# Altium project Charger.PrjPcb
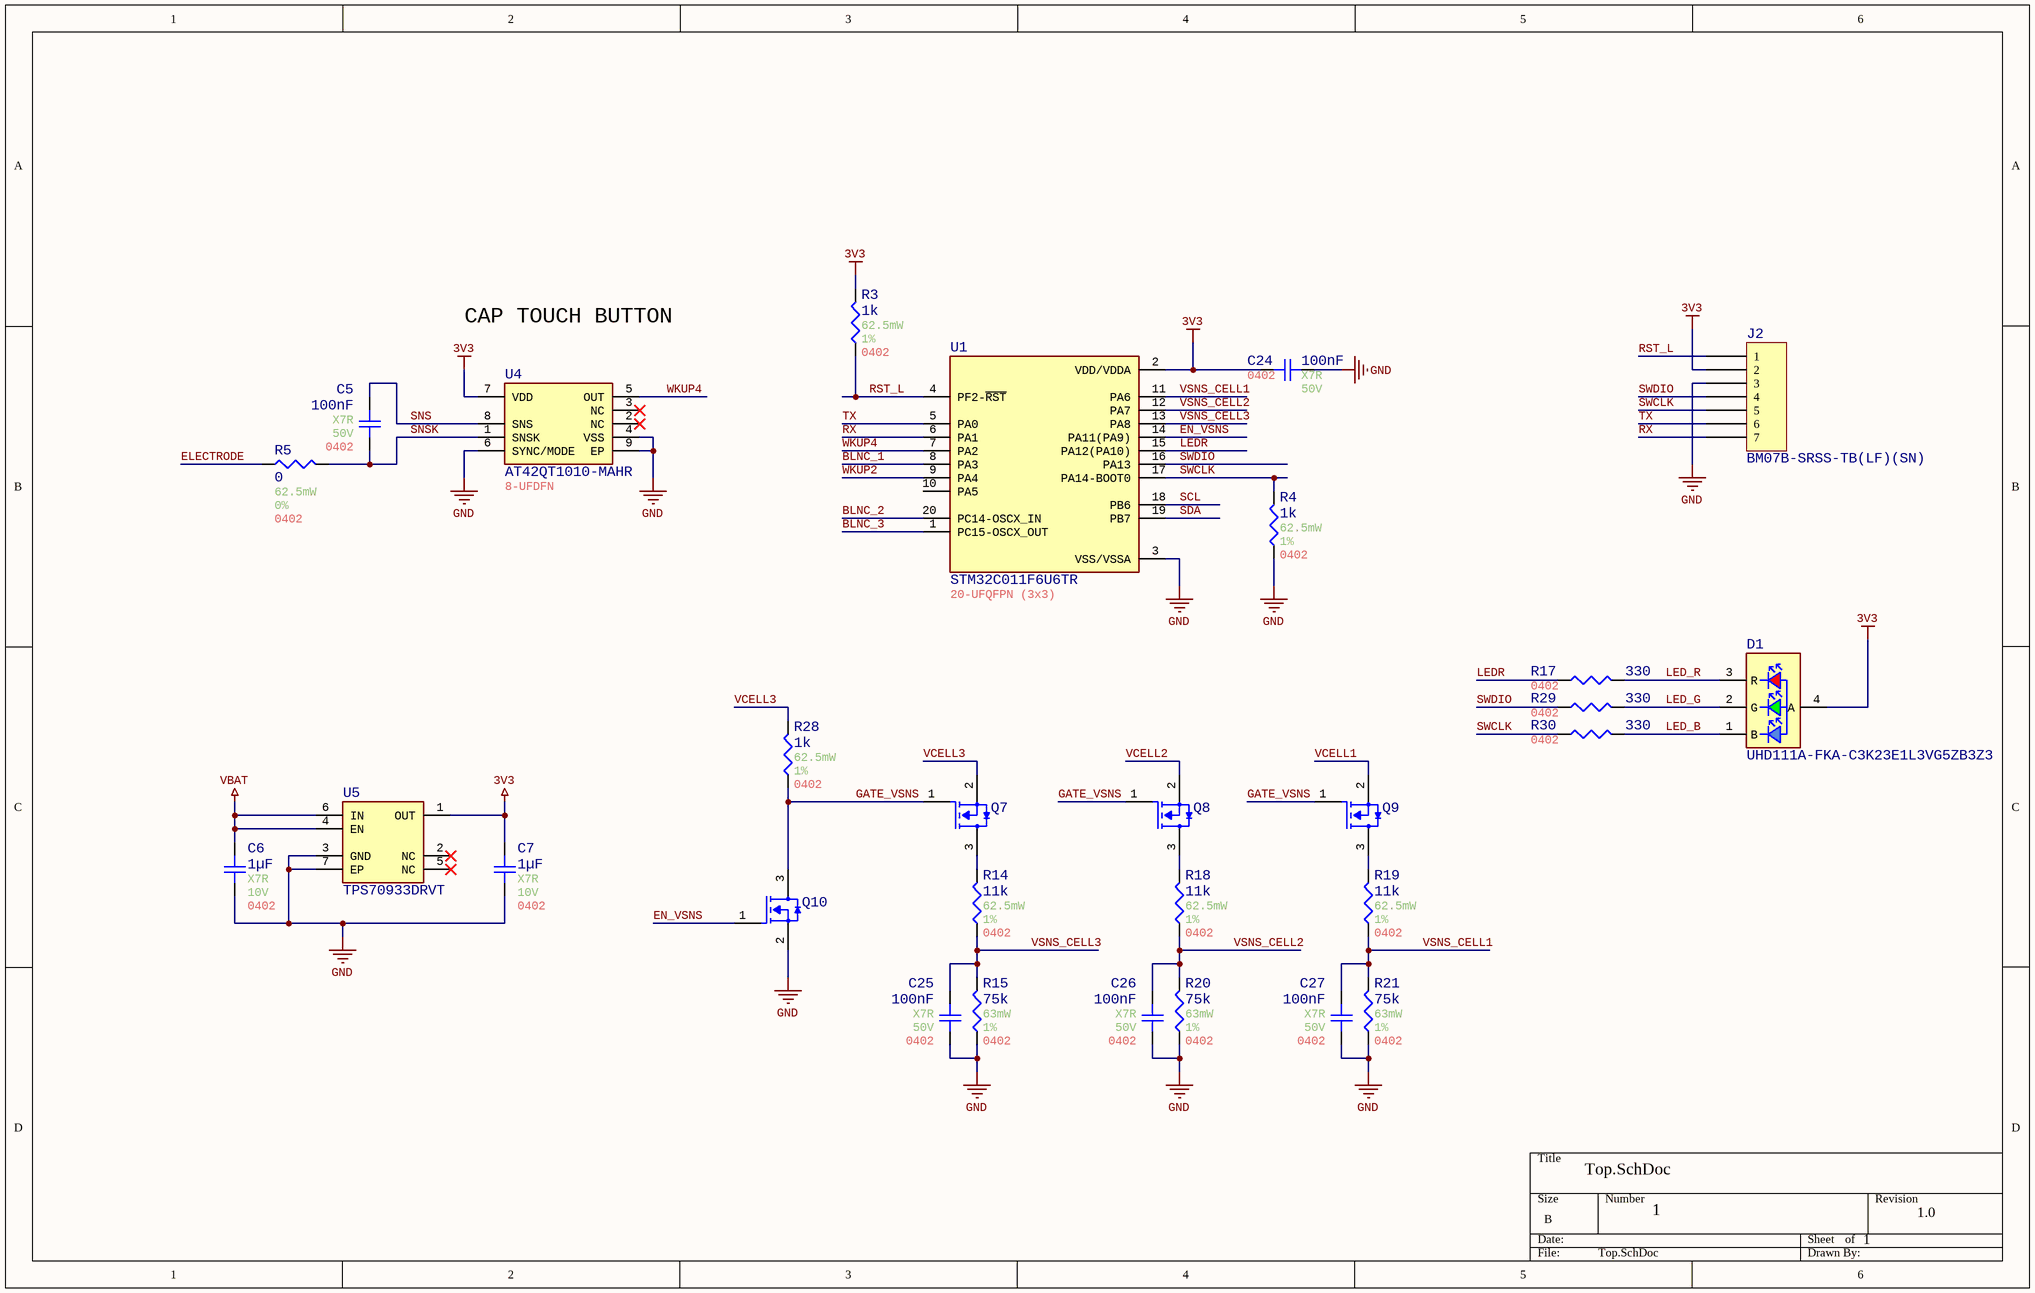
[diagram p0: Top.SchDoc]
ProjectRevision: 1.0
2 sheets, 75 parts. Net scope: global (net labels, ports and power ports of the same name join across sheets).
Board file: Charger.PcbDoc
Sheets:
  Top.SchDoc
  Power.SchDoc

## Sheet Top.SchDoc
size B; DocumentNumber: 1; SheetNumber: 1; SheetTotal: 1

### Parts
C5  value 100nF  Temperature Coefficient: X7R  Voltage Rating: 50V  Case/Package: 0402  [Generic 0402 capacitor]  (hidden comment: GRT155R71H104KE01D)
C6  value 1µF  Temperature Coefficient: X7R  Voltage Rating: 10V  Case/Package: 0402  [Generic 0402 capacitor]  (hidden comment: MAASL105CD7105MFCA01)
C7  value 1µF  Temperature Coefficient: X7R  Voltage Rating: 10V  Case/Package: 0402  [Generic 0402 capacitor]  (hidden comment: MAASL105CD7105MFCA01)
C24  value 100nF  Temperature Coefficient: X7R  Voltage Rating: 50V  Case/Package: 0402  [Generic 0402 capacitor]  (hidden comment: GRT155R71H104KE01D)
C25  value 100nF  Temperature Coefficient: X7R  Voltage Rating: 50V  Case/Package: 0402  [Generic 0402 capacitor]  (hidden comment: GRT155R71H104KE01D)
C26  value 100nF  Temperature Coefficient: X7R  Voltage Rating: 50V  Case/Package: 0402  [Generic 0402 capacitor]  (hidden comment: GRT155R71H104KE01D)
C27  value 100nF  Temperature Coefficient: X7R  Voltage Rating: 50V  Case/Package: 0402  [Generic 0402 capacitor]  (hidden comment: GRT155R71H104KE01D)
D1  UHD111A-FKA-C3K23E1L3VG5ZB3Z3  [UHD111A-FKA-C3K23E1L3VG5ZB3Z3]
J2  BM07B-SRSS-TB(LF)(SN)  [JST BM07B-SRSS-TB]
Q7  DMN61D9UWQ-7  [DMN61D9UWQ-7]  (value not drawn)
Q8  DMN61D9UWQ-7  [DMN61D9UWQ-7]  (value not drawn)
Q9  DMN61D9UWQ-7  [DMN61D9UWQ-7]  (value not drawn)
Q10  DMN61D9UWQ-7  [DMN61D9UWQ-7]  (value not drawn)
R3  value 1k  Power: 62.5mW  Tolerance: 1%  Case/Package: 0402  [Generic 0402 Resistor]  (hidden comment: WR04X1001FTL)
R4  value 1k  Power: 62.5mW  Tolerance: 1%  Case/Package: 0402  [Generic 0402 Resistor]  (hidden comment: WR04X1001FTL)
R5  value 0  Power: 62.5mW  Tolerance: 0%  Case/Package: 0402  [Generic 0402 Resistor]  (hidden comment: WR04X000PTL)
R14  value 11k  Power: 62.5mW  Tolerance: 1%  Case/Package: 0402  [Generic 0402 Resistor]  (hidden comment: RMCF0402FT11K0)
R15  value 75k  Power: 63mW  Tolerance: 1%  Case/Package: 0402  [Generic 0402 Resistor]  (hidden comment: WR04X7502FTL)
R17  value 330  Case/Package: 0402  [Generic 0402 Resistor]  (hidden comment: RMCF0402FT330R)
R18  value 11k  Power: 62.5mW  Tolerance: 1%  Case/Package: 0402  [Generic 0402 Resistor]  (hidden comment: RMCF0402FT11K0)
R19  value 11k  Power: 62.5mW  Tolerance: 1%  Case/Package: 0402  [Generic 0402 Resistor]  (hidden comment: RMCF0402FT11K0)
R20  value 75k  Power: 63mW  Tolerance: 1%  Case/Package: 0402  [Generic 0402 Resistor]  (hidden comment: WR04X7502FTL)
R21  value 75k  Power: 63mW  Tolerance: 1%  Case/Package: 0402  [Generic 0402 Resistor]  (hidden comment: WR04X7502FTL)
R28  value 1k  Power: 62.5mW  Tolerance: 1%  Case/Package: 0402  [Generic 0402 Resistor]  (hidden comment: WR04X1001FTL)
R29  value 330  Case/Package: 0402  [Generic 0402 Resistor]  (hidden comment: RMCF0402FT330R)
R30  value 330  Case/Package: 0402  [Generic 0402 Resistor]  (hidden comment: RMCF0402FT330R)
U1  STM32C011F6U6TR  [20-UFQFPN (3x3)]
U4  AT42QT1010-MAHR  Case/Package: 8-UFDFN  [AT42QT1010-MAHR]
U5  TPS70933DRVT  [WSON_6_2.0x2.0x0.8mm_0.65P]

### Nets
3V3: C7.2 C24.2 D1.4(A) J2.2 R3.2 U1.2(VDD/VDDA) U4.7(VDD) U5.1(OUT)
GND: C6.1 C7.1 C24.1 C25.1 C26.1 C27.1 J2.3 Q10.2(SOURCE) R4.1 R15.1 R20.1 R21.1 U1.3(VSS/VSSA) U4.4(VSS) U4.6(SYNC/MODE) U4.9(EP) U5.3(GND) U5.7(EP)
VCELL3: C6.2 Q7.2(SOURCE) R28.2 U5.4(EN) U5.6(IN)  [also labelled VBAT]
BLNC_1: U1.8(PA3)
BLNC_2: U1.20(PC14-OSCX_IN)
BLNC_3: U1.1(PC15-OSCX_OUT)
ELECTRODE: R5.1
EN_VSNS: Q10.1(GATE) U1.14(PA11(PA9))
GATE_VSNS: Q7.1(GATE) Q8.1(GATE) Q9.1(GATE) Q10.3(DRAIN) R28.1
LED_B: D1.1(B) R30.2
LED_G: D1.2(G) R29.2
LED_R: D1.3(R) R17.2
LEDR: R17.1 U1.15(PA12(PA10))
RST_L: J2.1 R3.1 U1.4(PF2-~{RST})
RX: J2.7 U1.6(PA1)
SCL: U1.18(PB6)
SDA: U1.19(PB7)
SNS: C5.2 U4.8(SNS)
SNSK: C5.1 R5.2 U4.1(SNSK)
SWCLK: J2.5 R4.2 R30.1 U1.17(PA14-BOOT0)
SWDIO: J2.4 R29.1 U1.16(PA13)
TX: J2.6 U1.5(PA0)
VCELL1: Q9.2(SOURCE)
VCELL2: Q8.2(SOURCE)
VSNS_CELL1: C27.2 R19.1 R21.2 U1.11(PA6)
VSNS_CELL2: C26.2 R18.1 R20.2 U1.12(PA7)
VSNS_CELL3: C25.2 R14.1 R15.2 U1.13(PA8)
WKUP2: U1.9(PA4)
WKUP4: U1.7(PA2) U4.5(OUT)
NetQ7_3: Q7.3(DRAIN) R14.2
NetQ8_3: Q8.3(DRAIN) R18.2
NetQ9_3: Q9.3(DRAIN) R19.2

Not connected (* = marked no-connect by the designer): U1 10(PA5); U4 2(NC)* 3(NC)*; U5 2(NC)* 5(NC)*

### Notes on the sheet
- CAP TOUCH BUTTON

### Library data of the parts
C5 C24-C27 = CMP-001-00084-12: Ceramic Capacitor, Multilayer, Ceramic, 50V, 10% +Tol, 10% -Tol, X7R, 15% TC, 0.1uF, Surface Mount, 0402; Multilayer: Yes; Terminal Finish: Nickel; Capacitor Type: Ceramic; Package Shape: Rectangular; Reach SVHC Compliant: Yes; Max Operating Temperature: 125°C; RoHS Compliant: Yes; Termination: Wraparound; Packaging: Tape and Reel; AECQ: Yes; Pins: 2; Dielectric Material: Ceramic; Min Operating Temperature: -55°C; Tolerance: 10%; Mounting Technology: Surface Mount
C6 C7 = CMP-001-00104-2: Cap Cer 1UF 20V X7T 0402; AECQ: Yes; Capacitor Type: Ceramic; Tolerance: 20%; Min Operating Temperature: -55°C; Max Operating Temperature: 125°C; Pins: 2; RoHS Compliant: Yes; Mounting Technology: Surface Mount
D1 = CMP-007-00049-1: LED Chip Blue/Green/Red 469nm/528nm/622nm 10A/10A/10A 4-Pin SMD T/R
J2 = BM07B-SRSS-TB(LF)(SN): CONN HEADER SMD 7POS 1MM; Manufacturer: JST Sales America Inc.; Current Rating (Amps): 0.7A; Material Flammability Rating: UL94 V-0; Number of Positions: 7; Number of Positions Loaded: All; Pitch - Mating: 0.039" (1.00mm); Shrouding: Shrouded - 4 Wall; Style: Board to Cable/Wire; Voltage Rating: 50V; Part Number: BM07B-SRSS-TB(LF)(SN); ComponentLink1Description: Datasheet; ComponentLink1URL: http://www.jst-mfg.com/product/pdf/eng/eSH.pdf; ComponentLink2Description: DigiKey Link; ComponentLink2URL: http://digikey.com/product-detail/en/jst-sales-america-inc/BM07B-SRSS-TB-LF-SN/455-1793-1-ND/926864; Connector Type: Header; Contact Finish - Mating: Tin; Contact Finish - Post: Tin; Contact Material: Copper Alloy; Contact Shape: Square; Contact Type: Male Pin; Fastening Type: Push-Pull; Features: Solder Retention; Insulation Color: Natural; Insulation Height: 0.167" (4.25mm); Insulation Material: Polyamide (PA), Nylon; LastUpdated: 1/12/2020 10:15:04 PM; Lifecycle Status: Active; Minimum Order: 1; Mounting Type: Surface Mount; Number of Rows: 1; Operating Temperature: -25°C ~ 85°C; Packaging: TapeAndReel; PartId: 22; Part Status: Active; Price: 0.42; Series: SR; Supplier 1: DigiKey; Supplier Part Number 1: 455-1793-1-ND; Termination: Solder
Q7-Q10 = CMP-013-00037-3: Small Signal Field-Effect Transistor; Transistor Type: n-FET; Min Operating Temperature: -55°C; Max Operating Temperature: 175°C; RoHS Compliant: Yes
R3 R4 R28 = CMP-009-00182-8: Fixed Resistor, Metal Glaze/thick Film, 0.0625W, 1000ohm, 50V, 1% +/-Tol, 100ppm/Cel, Surface Mount, 0402; Manufacturer Part Number: Blank; AECQ: No; Package Height: 0.35mm; Additional Feature: LASER TRIMMABLE; Rated Temperature: 70°C; Package Length: 1mm; Temperature Coefficient (ppm/Cel): 100; Package Width: 0.5mm; RoHS Compliant: Yes; Technology: METAL GLAZE/THICK FILM; Max Operating Temperature: 155°C; Mounting Technology: Surface Mount; JESD-609 Code: e3; Terminal Finish: Nickel; Working Voltage: 50V; Min Operating Temperature: -55°C; Pins: 2; Reach SVHC Compliant: Yes; Termination: Wraparound; Resistor Type: FIXED RESISTOR; Packaging: Tape and Reel; Package Shape: Rectangular; Construction: Chip
R5 = CMP-009-00186-8: Fixed Resistor, Metal Glaze/thick Film, 0.0625W, 0ohm, Surface Mount, 0402; Manufacturer Part Number: Blank; AECQ: No; Package Length: 1mm; Rated Temperature: 70°C; Package Height: 0.35mm; Package Width: 0.5mm; Resistor Type: FIXED RESISTOR; RoHS Compliant: Yes; Package Shape: Rectangular; Construction: Chip; Terminal Finish: Nickel; JESD-609 Code: e3; Pins: 2; Mounting Technology: Surface Mount; Technology: METAL GLAZE/THICK FILM; Termination: Wraparound; Reach SVHC Compliant: Yes; Min Operating Temperature: -55°C; Max Operating Temperature: 155°C; Packaging: Tape and Reel
R14 R18 R19 = CMP-009-00221-1: Res Thick Film 0402 11K Ohm 1% 0.063W(1/16W) ±100ppm/C Pad SMD Automotive T/R; AECQ: Yes; Pins: 2; RoHS Compliant: Yes; Max Operating Temperature: 155°C; Mounting Technology: Surface Mount; Min Operating Temperature: -55°C
R15 R20 R21 = CMP-009-00227-1: Res Thick Film 0402 75K Ohm 1% 0.063W(1/16W) ±100ppm/C Pad SMD T/R; AECQ: Yes; Max Operating Temperature: 155°C; Min Operating Temperature: -55°C; Pins: 2; Mounting Technology: SMD
R17 R29 R30 = CMP-009-00225-1: Res Thick Film 0402 330 Ohm 1% 0.063W ±100ppm/°C Molded SMD Paper T/R; Power: 62.5mW; AECQ: Yes; Tolerance: 1%; Mounting Technology: Surface Mount; Max Operating Temperature: 155°C; RoHS Compliant: Yes; Pins: 2; Min Operating Temperature: -55°C
U1 = CMP-020-00029-2: RISC Microcontroller, 32-Bit, FLASH, CORTEX-M4F CPU, 180MHz, CMOS, PBGA216; EEPROM Memory Size: 0B; Max Supply Voltage: 3.6V; Max Supply Current: 4.1mA; Clock Frequency: 48MHz; ADC Channels (Resolution): 13-Ch 12-Bit; Interface: I2C, I2S, SPI; Min Supply Voltage: 3V; Number of I/Os: 2; RAM Size: 6kB; Peripherals: POR, PWM; Case/Package: 20-UFQFPN (3x3); Height - Seated (Max): 600µm; Terminal Pitch: 500µm; Length: 3mm; Width: 3mm; Min Operating Temperature: -40°C; Max Operating Temperature: 85°C; Memory Format: FLASH; Operating Supply Voltage: 3V
U4 = CMP-010-00042-1: S-PDSO-N8 Buttons 1997 Tape & Reel (TR) capacitive touch sensor 2mm 378.5muA 14b 1.8V~5.5V; Min Supply Voltage: 1.8V; Max Supply Voltage: 5.5V; Pins: 8; Max Operating Temperature: 85°C; Min Operating Temperature: -40°C
U5 = CMP-019-00070-2: INTERSIL DG412DJZ Analogue Switch, SPST, 4 Channels, 35 ohm, 5V to 34V, DIP, 16 Pins; Output Voltage: 3.3V; Min Supply Voltage: 3.66V; Nominal Supply Current: 2µA; Max Supply Voltage: 28V; Output Current: 150mA; Case/Package: 6-WSON (2x2); Pins: 6; Max Operating Temperature: 125°C; RoHS Compliant: Yes; Min Operating Temperature: -40°C; Mounting Technology: SMT

## Sheet Power.SchDoc
size B
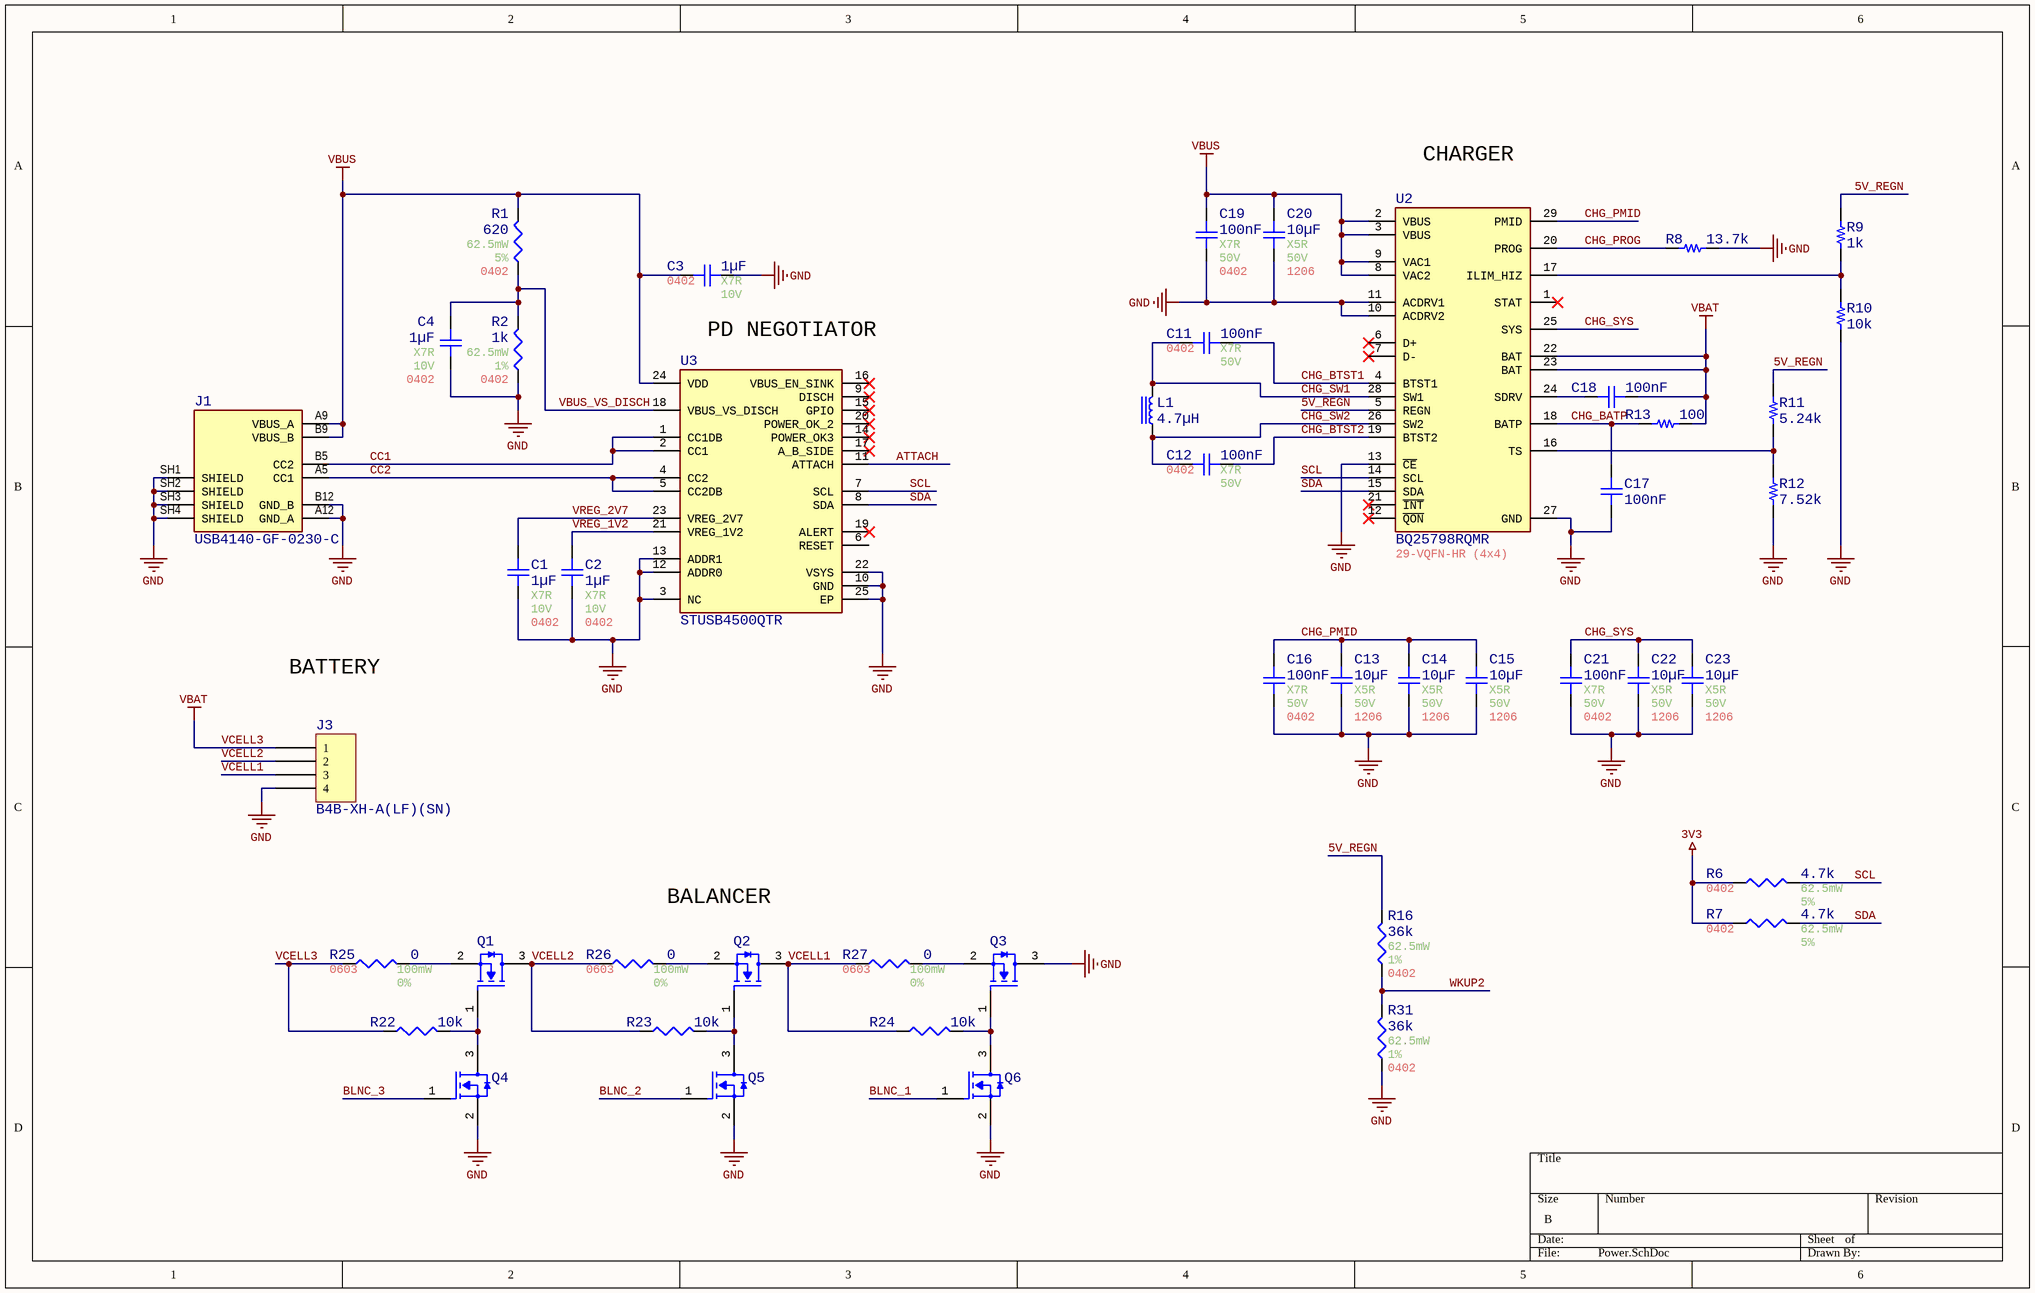
[diagram p1: Power.SchDoc]

### Parts
C1  value 1µF  Temperature Coefficient: X7R  Voltage Rating: 10V  Case/Package: 0402  [Generic 0402 capacitor]  (hidden comment: MAASL105CD7105MFCA01)
C2  value 1µF  Temperature Coefficient: X7R  Voltage Rating: 10V  Case/Package: 0402  [Generic 0402 capacitor]  (hidden comment: MAASL105CD7105MFCA01)
C3  value 1µF  Temperature Coefficient: X7R  Voltage Rating: 10V  Case/Package: 0402  [Generic 0402 capacitor]  (hidden comment: MAASL105CD7105MFCA01)
C4  value 1µF  Temperature Coefficient: X7R  Voltage Rating: 10V  Case/Package: 0402  [Generic 0402 capacitor]  (hidden comment: MAASL105CD7105MFCA01)
C11  value 100nF  Temperature Coefficient: X7R  Voltage Rating: 50V  Case/Package: 0402  [Generic 0402 capacitor]  (hidden comment: GRT155R71H104KE01D)
C12  value 100nF  Temperature Coefficient: X7R  Voltage Rating: 50V  Case/Package: 0402  [Generic 0402 capacitor]  (hidden comment: GRT155R71H104KE01D)
C13  value 10µF  Temperature Coefficient: X5R  Voltage Rating: 50V  Case/Package: 1206  [Generic 1206 Capacitor]  (hidden comment: CL31A106MBHNNNE)
C14  value 10µF  Temperature Coefficient: X5R  Voltage Rating: 50V  Case/Package: 1206  [Generic 1206 Capacitor]  (hidden comment: CL31A106MBHNNNE)
C15  value 10µF  Temperature Coefficient: X5R  Voltage Rating: 50V  Case/Package: 1206  [Generic 1206 Capacitor]  (hidden comment: CL31A106MBHNNNE)
C16  value 100nF  Temperature Coefficient: X7R  Voltage Rating: 50V  Case/Package: 0402  [Generic 0402 capacitor]  (hidden comment: GRT155R71H104KE01D)
C17  value 100nF  [Generic 0402 capacitor]  (hidden comment: GRT155R71H104KE01D)
C18  value 100nF  [Generic 0402 capacitor]  (hidden comment: GRT155R71H104KE01D)
C19  value 100nF  Temperature Coefficient: X7R  Voltage Rating: 50V  Case/Package: 0402  [Generic 0402 capacitor]  (hidden comment: GRT155R71H104KE01D)
C20  value 10µF  Temperature Coefficient: X5R  Voltage Rating: 50V  Case/Package: 1206  [Generic 1206 Capacitor]  (hidden comment: CL31A106MBHNNNE)
C21  value 100nF  Temperature Coefficient: X7R  Voltage Rating: 50V  Case/Package: 0402  [Generic 0402 capacitor]  (hidden comment: GRT155R71H104KE01D)
C22  value 10µF  Temperature Coefficient: X5R  Voltage Rating: 50V  Case/Package: 1206  [Generic 1206 Capacitor]  (hidden comment: CL31A106MBHNNNE)
C23  value 10µF  Temperature Coefficient: X5R  Voltage Rating: 50V  Case/Package: 1206  [Generic 1206 Capacitor]  (hidden comment: CL31A106MBHNNNE)
J1  USB4140-GF-0230-C  [USB4140-GF-0230-C]
J3  B4B-XH-A(LF)(SN)  [JST XH B4B-XH-A]
L1  4.7µH  [IND 1008_2520]
Q1  DMN61D9UWQ-7  [DMN61D9UWQ-7]  (value not drawn)
Q2  DMN61D9UWQ-7  [DMN61D9UWQ-7]  (value not drawn)
Q3  DMN61D9UWQ-7  [DMN61D9UWQ-7]  (value not drawn)
Q4  DMN61D9UWQ-7  [DMN61D9UWQ-7]  (value not drawn)
Q5  DMN61D9UWQ-7  [DMN61D9UWQ-7]  (value not drawn)
Q6  DMN61D9UWQ-7  [DMN61D9UWQ-7]  (value not drawn)
R1  value 620  Power: 62.5mW  Tolerance: 5%  Case/Package: 0402  [Generic 0402 Resistor]  (hidden comment: RC0402JR-07620RL)
R2  value 1k  Power: 62.5mW  Tolerance: 1%  Case/Package: 0402  [Generic 0402 Resistor]  (hidden comment: WR04X1001FTL)
R6  value 4.7k  Power: 62.5mW  Tolerance: 5%  Case/Package: 0402  [Generic 0402 Resistor]  (hidden comment: WR04X472JTL)
R7  value 4.7k  Power: 62.5mW  Tolerance: 5%  Case/Package: 0402  [Generic 0402 Resistor]  (hidden comment: WR04X472JTL)
R8  13.7k  [RES_0402]
R9  1k  [RES_0402]
R10  10k  [RES_0402]
R11  5.24k  [RES_0402]
R12  7.52k  [RES_0402]
R13  100  [RES_0402]
R16  value 36k  Power: 62.5mW  Tolerance: 1%  Case/Package: 0402  [Generic 0402 Resistor]  (hidden comment: AC0402FR-0736KL)
R22  value 10k  [Generic 0402 Resistor]  (hidden comment: WR04X103JTL)
R23  value 10k  [Generic 0402 Resistor]  (hidden comment: WR04X103JTL)
R24  value 10k  [Generic 0402 Resistor]  (hidden comment: WR04X103JTL)
R25  value 0  Power: 100mW  Tolerance: 0%  Case/Package: 0603  [Generic 0603 Resistor]  (hidden comment: WR06X000PTL)
R26  value 0  Power: 100mW  Tolerance: 0%  Case/Package: 0603  [Generic 0603 Resistor]  (hidden comment: WR06X000PTL)
R27  value 0  Power: 100mW  Tolerance: 0%  Case/Package: 0603  [Generic 0603 Resistor]  (hidden comment: WR06X000PTL)
R31  value 36k  Power: 62.5mW  Tolerance: 1%  Case/Package: 0402  [Generic 0402 Resistor]  (hidden comment: AC0402FR-0736KL)
U2  BQ25798RQMR  [29-VQFN-HR (4x4)]
U3  STUSB4500QTR  [FP-QFN-24-EP_4x4-MFG]

### Nets
3V3: R6.1 R7.1
GND: C1.1 C2.1 C3.1 C4.1 C13.1 C14.1 C15.1 C16.2 C17.2 C19.2 C20.1 C21.2 C22.1 C23.1 J1.A12(GND_A) J1.B12(GND_B) J1.SH1(SHIELD) J1.SH2(SHIELD) J1.SH3(SHIELD) J1.SH4(SHIELD) J3.4 Q3.3(DRAIN) Q4.2(SOURCE) Q5.2(SOURCE) Q6.2(SOURCE) R2.1 R8.1 R10.2 R12.2 R31.1 U2.10(ACDRV2) U2.11(ACDRV1) U2.13(~{CE}) U2.27(GND) U3.3(NC) U3.10(GND) U3.12(ADDR0) U3.13(ADDR1) U3.22(VSYS) U3.25(EP)
VBUS: C3.2 C19.1 C20.2 J1.A9(VBUS_A) J1.B9(VBUS_B) R1.2 U2.2(VBUS) U2.3(VBUS) U2.8(VAC2) U2.9(VAC1) U3.24(VDD)
VCELL3: C18.2 J3.1 R13.1 R22.1 R25.1 U2.22(BAT) U2.23(BAT)  [also labelled VBAT]
5V_REGN: R9.1 R11.1 R16.2 U2.5(REGN)
ATTACH: U3.11(ATTACH)
BLNC_1: Q6.1(GATE)
BLNC_2: Q5.1(GATE)
BLNC_3: Q4.1(GATE)
CC1: J1.B5(CC2) U3.1(CC1DB) U3.2(CC1)
CC2: J1.A5(CC1) U3.4(CC2) U3.5(CC2DB)
CHG_BATP: C17.1 R13.2 U2.18(BATP)
CHG_BTST1: C11.1 U2.4(BTST1)
CHG_BTST2: C12.1 U2.19(BTST2)
CHG_PMID: C13.2 C14.2 C15.2 C16.1 U2.29(PMID)
CHG_PROG: R8.2 U2.20(PROG)
CHG_SW1: C11.2 L1.2 U2.28(SW1)
CHG_SW2: C12.2 L1.1 U2.26(SW2)
CHG_SYS: C21.1 C22.2 C23.2 U2.25(SYS)
SCL: R6.2 U2.14(SCL) U3.7(SCL)
SDA: R7.2 U2.15(SDA) U3.8(SDA)
VBUS_VS_DISCH: C4.2 R1.1 R2.2 U3.18(VBUS_VS_DISCH)
VCELL1: J3.3 Q2.3(DRAIN) R24.1 R27.1
VCELL2: J3.2 Q1.3(DRAIN) R23.1 R26.1
VREG_1V2: C2.2 U3.21(VREG_1V2)
VREG_2V7: C1.2 U3.23(VREG_2V7)
WKUP2: R16.1 R31.2
NetC18_1: C18.1 U2.24(SDRV)
NetQ1_1: Q1.1(GATE) Q4.3(DRAIN) R22.2
NetQ1_2: Q1.2(SOURCE) R25.2
NetQ2_1: Q2.1(GATE) Q5.3(DRAIN) R23.2
NetQ2_2: Q2.2(SOURCE) R26.2
NetQ3_1: Q3.1(GATE) Q6.3(DRAIN) R24.2
NetQ3_2: Q3.2(SOURCE) R27.2
NetR9_2: R9.2 R10.1 U2.17(ILIM_HIZ)
NetR11_2: R11.2 R12.1 U2.16(TS)

Not connected (* = marked no-connect by the designer): U2 1(STAT)* 6(D+)* 7(D-)* 12(~{QON})* 21(~{INT})*; U3 6(RESET) 9(DISCH)* 14(POWER_OK3)* 15(GPIO)* 16(VBUS_EN_SINK)* 17(A_B_SIDE)* 19(ALERT)* 20(POWER_OK_2)*

### Notes on the sheet
- CHARGER
- PD NEGOTIATOR
- BATTERY
- BALANCER

### Library data of the parts
C1-C4 = CMP-001-00104-2: as C6 on sheet Top; Min Operating Temperature: -55°C; Max Operating Temperature: 125°C; Pins: 2; RoHS Compliant: Yes; Mounting Technology: Surface Mount
C11 C12 C16-C19 C21 = CMP-001-00084-12: as C5 on sheet Top; Terminal Finish: Nickel; Capacitor Type: Ceramic; Package Shape: Rectangular; Reach SVHC Compliant: Yes; Max Operating Temperature: 125°C; RoHS Compliant: Yes; Termination: Wraparound; Packaging: Tape and Reel; AECQ: Yes; Pins: 2; Dielectric Material: Ceramic; Min Operating Temperature: -55°C; Tolerance: 10%; Mounting Technology: Surface Mount
  C17 C18: Temperature Coefficient: X7R; Voltage Rating: 50V; Case/Package: 0402
C13-C15 C20 C22 C23 = CMP-001-00092-6: Ceramic Capacitor, Multilayer, Ceramic, 50V, 20% +Tol, 20% -Tol, X5R, 15% TC, 10uF, Surface Mount, 1206; AECQ: No; Multilayer: Yes; Reach SVHC Compliant: Yes; Package Shape: Rectangular; Temperature Characteristics Code: X5R; RoHS Compliant: Yes; Max Operating Temperature: 85°C; Mounting Technology: Surface Mount; Capacitor Type: Ceramic; Pins: 2; Packaging: Tape and Reel; Terminal Finish: Nickel; Tolerance: 20%; Termination: Wraparound; Dielectric Material: Ceramic; JESD-609 Code: e3; Min Operating Temperature: -55°C
J1 = CMP-002-00127-3: USB Connector, 6 Contact(s), Female, Straight, Surface Mount Terminal, Locking, Receptacle; Manufacturer: Molex; Max Current Rating: 5A; Gender: RCPT; Connector Type: USB-C; Min Operating Temperature: -25°C; Pins: 6; Max Operating Temperature: 85°C
J3 = B4B-XH-A(LF)(SN): CONN HEADER VERT 4POS 2.5MM; Manufacturer: JST Sales America Inc.; Contact Length - Post: 0.134" (3.40mm); Current Rating (Amps): 3A; Material Flammability Rating: UL94 V-0; Number of Positions: 4; Number of Positions Loaded: All; Pitch - Mating: 0.098" (2.50mm); Shrouding: Shrouded - 4 Wall; Style: Board to Cable/Wire; Voltage Rating: 250V; Part Number: B4B-XH-A(LF)(SN); ComponentLink1Description: Datasheet; ComponentLink1URL: http://www.jst-mfg.com/product/pdf/eng/eXH.pdf; ComponentLink2Description: DigiKey Link; ComponentLink2URL: http://digikey.com/product-detail/en/jst-sales-america-inc/B4B-XH-A-LF-SN/455-2249-ND/1651047; Connector Type: Header; Contact Finish - Mating: Tin; Contact Finish - Post: Tin; Contact Material: Brass; Contact Shape: Square; Contact Type: Male Pin; Fastening Type: Detent Lock; Insulation Color: Natural; Insulation Height: 0.276" (7.00mm); Insulation Material: Polyamide (PA66), Nylon 6/6; LastUpdated: 1/12/2020 11:46:34 PM; Lifecycle Status: Active; Minimum Order: 1; Mounting Type: Through Hole; Number of Rows: 1; Operating Temperature: -25°C ~ 85°C; Packaging: Bulk; PartId: 69; Part Status: Active; Price: 0.21; Series: XH; Supplier 1: DigiKey; Supplier Part Number 1: 455-2249-ND; Termination: Press-Fit, Solder
L1 = MLP2520S4R7ST0S1: FIXED IND 4.7UH 1A 110 MOHM SMD; Manufacturer: TDK Corporation; DC Resistance (DCR): 143mOhm Max; Inductance Frequency - Test: 2MHz; Material - Core: Ferrite; Shielding: Shielded; Tolerance: ±20%; Type: Multilayer; Part Number: MLP2520S4R7ST0S1; ComponentLink1Description: Datasheet; ComponentLink1URL: https://product.tdk.com/info/en/catalog/datasheets/inductor_commercial_power_mlp2520_en.pdf?ref_disty=digikey; ComponentLink2Description: DigiKey Link; ComponentLink2URL: http://digikey.com/product-detail/en/tdk-corporation/MLP2520S4R7ST0S1/445-6378-1-ND/2465705; Current Rating (Amps): 1A; Device Package: 1008 (2520 Metric); Height - Seated (Max): 0.039" (1.00mm); Inductance: 4.7µH; LastUpdated: 9/2/2020 1:29:23 AM; Lifecycle Status: Active; Minimum Order: 1; Mounting Type: Surface Mount; Operating Temperature: -40°C ~ 125°C; Package / Case: 1008 (2520 Metric); Packaging: TapeAndReel; PartId: 3467; Part Status: Active; Price: 0.14; Series: MLP; Size / Dimension: 0.098" L x 0.079" W (2.50mm x 2.00mm); Supplier 1: DigiKey; Supplier Part Number 1: 445-6378-1-ND; Supplier Device Package: 1008 (2520 Metric); Value: 4.7µH
Q1-Q6 = CMP-013-00037-3: as Q7 on sheet Top; Min Operating Temperature: -55°C; Max Operating Temperature: 175°C; RoHS Compliant: Yes
R1 = CMP-009-00209-4: Fixed Resistor, Metal Glaze/thick Film, 0.0625W, 620ohm, 50V, 5% +/-Tol, 100ppm/Cel, Surface Mount, 0402; AECQ: No; Pins: 2; Min Operating Temperature: -55°C; RoHS Compliant: Yes; Mounting Technology: Surface Mount; Max Operating Temperature: 155°C
R2 = CMP-009-00182-8: as R3 on sheet Top; RoHS Compliant: Yes; Technology: METAL GLAZE/THICK FILM; Max Operating Temperature: 155°C; Mounting Technology: Surface Mount; JESD-609 Code: e3; Terminal Finish: Nickel; Working Voltage: 50V; Min Operating Temperature: -55°C; Pins: 2; Reach SVHC Compliant: Yes; Termination: Wraparound; Resistor Type: FIXED RESISTOR; Packaging: Tape and Reel; Package Shape: Rectangular; Construction: Chip
R6 R7 = CMP-009-00184-8: Fixed Resistor, Metal Glaze/thick Film, 0.0625W, 4700ohm, 50V, 5% +/-Tol, 100ppm/Cel, Surface Mount, 0402; Manufacturer Part Number: Blank; Package Height: 0.35mm; Package Length: 1mm; Rated Temperature: 70°C; Package Width: 0.5mm; AECQ: No; Temperature Coefficient (ppm/Cel): 200; Additional Feature: LASER TRIMMABLE; Mounting Technology: Surface Mount; Technology: METAL GLAZE/THICK FILM; RoHS Compliant: Yes; Resistor Type: FIXED RESISTOR; Package Shape: Rectangular; Pins: 2; Construction: Chip; Terminal Finish: Nickel; Max Operating Temperature: 155°C; Working Voltage: 50V; Packaging: Tape and Reel; Termination: Wraparound; JESD-609 Code: e3; Reach SVHC Compliant: Yes; Min Operating Temperature: -55°C
R8-R13 = RES_0402: RES 0402
R16 R31 = CMP-009-00198-3: Fixed Resistor, Metal Glaze/thick Film, 0.0625W, 36000ohm, 50V, 1% +/-Tol, 100ppm/Cel, Surface Mount, 0402; AECQ: Yes; Pins: 2; Mounting Technology: SMD; Min Operating Temperature: -55°C; Max Operating Temperature: 155°C
R22-R24 = CMP-009-00185-8: Fixed Resistor, Metal Glaze/thick Film, 0.0625W, 10000ohm, 50V, 5% +/-Tol, 100ppm/Cel, Surface Mount, 0402; Manufacturer Part Number: Blank; Power: 62.5mW; Rated Temperature: 70°C; Package Length: 1mm; Package Width: 0.5mm; Temperature Coefficient (ppm/Cel): 200; Additional Feature: LASER TRIMMABLE; Package Height: 0.35mm; AECQ: No; Tolerance: 5%; Case/Package: 0402; Termination: Wraparound; Terminal Finish: Nickel; RoHS Compliant: Yes; Technology: METAL GLAZE/THICK FILM; Packaging: Tape and Reel; Package Shape: Rectangular; Construction: Rectangular; Resistor Type: FIXED RESISTOR; Mounting Technology: Surface Mount; Max Operating Temperature: 155°C; Pins: 2; JESD-609 Code: e3; Reach SVHC Compliant: Yes; Working Voltage: 50V; Min Operating Temperature: -55°C
R25-R27 = CMP-009-00178-4: Fixed Resistor, Metal Glaze/thick Film, 0.1W, 0ohm, Surface Mount, 0603; Manufacturer Part Number: Blank; AECQ: No; Package Height: 0.45mm; Rated Temperature: 70°C; Package Length: 1.6mm; Package Width: 0.8mm; Mounting Technology: Surface Mount; Packaging: Tape and Reel; RoHS Compliant: Yes; Terminal Finish: Nickel; Termination: Wraparound; Max Operating Temperature: 155°C; Pins: 2; Resistor Type: FIXED RESISTOR; Package Shape: Rectangular; Min Operating Temperature: -55°C; JESD-609 Code: e3; Construction: Chip; Technology: METAL GLAZE/THICK FILM; Reach SVHC Compliant: Yes
U2 = CMP-031-00015-4: I²C controlled, 1-4-cell, 5-A buck-boost solar battery charger with dual-input selector and MPPT 29-VQFN-HR -40 to 85; AECQ: No; Min Operating Temperature: -40°C; Max Operating Temperature: 125°C; Pins: 29; Case/Package: 29-VQFN-HR (4x4); MPN: BQ25798RQMR
U3 = CMP-010-00041-2: Super Speed USB Controller USB 1.2/USB 2.0 5V/9V/12V/15V/18V T/R 24-Pin QFN EP; Operating Supply Voltage: 5V; Min Supply Voltage: 4.1V; Max Supply Voltage: 22V; Max Operating Temperature: 105°C; Min Operating Temperature: -40°C; Width: 4mm; Case/Package: 24-QFN (4x4)

## Nets that join several sheets
3V3: Top (8 pins), Power (R6.1 R7.1)
GND: Top (18 pins), Power (40 pins)
VCELL3: Top (5 pins), Power (7 pins)
BLNC_1: Top (U1.8), Power (Q6.1)
BLNC_2: Top (U1.20), Power (Q5.1)
BLNC_3: Top (U1.1), Power (Q4.1)
SCL: Top (U1.18), Power (R6.2 U2.14 U3.7)
SDA: Top (U1.19), Power (R7.2 U2.15 U3.8)
VCELL1: Top (Q9.2), Power (J3.3 Q2.3 R24.1 R27.1)
VCELL2: Top (Q8.2), Power (J3.2 Q1.3 R23.1 R26.1)
WKUP2: Top (U1.9), Power (R16.1 R31.2)

## Assembly variants
Main: all parts fitted